# EAGLE design TCS3472_breakout (EAGLE 7.3.0)
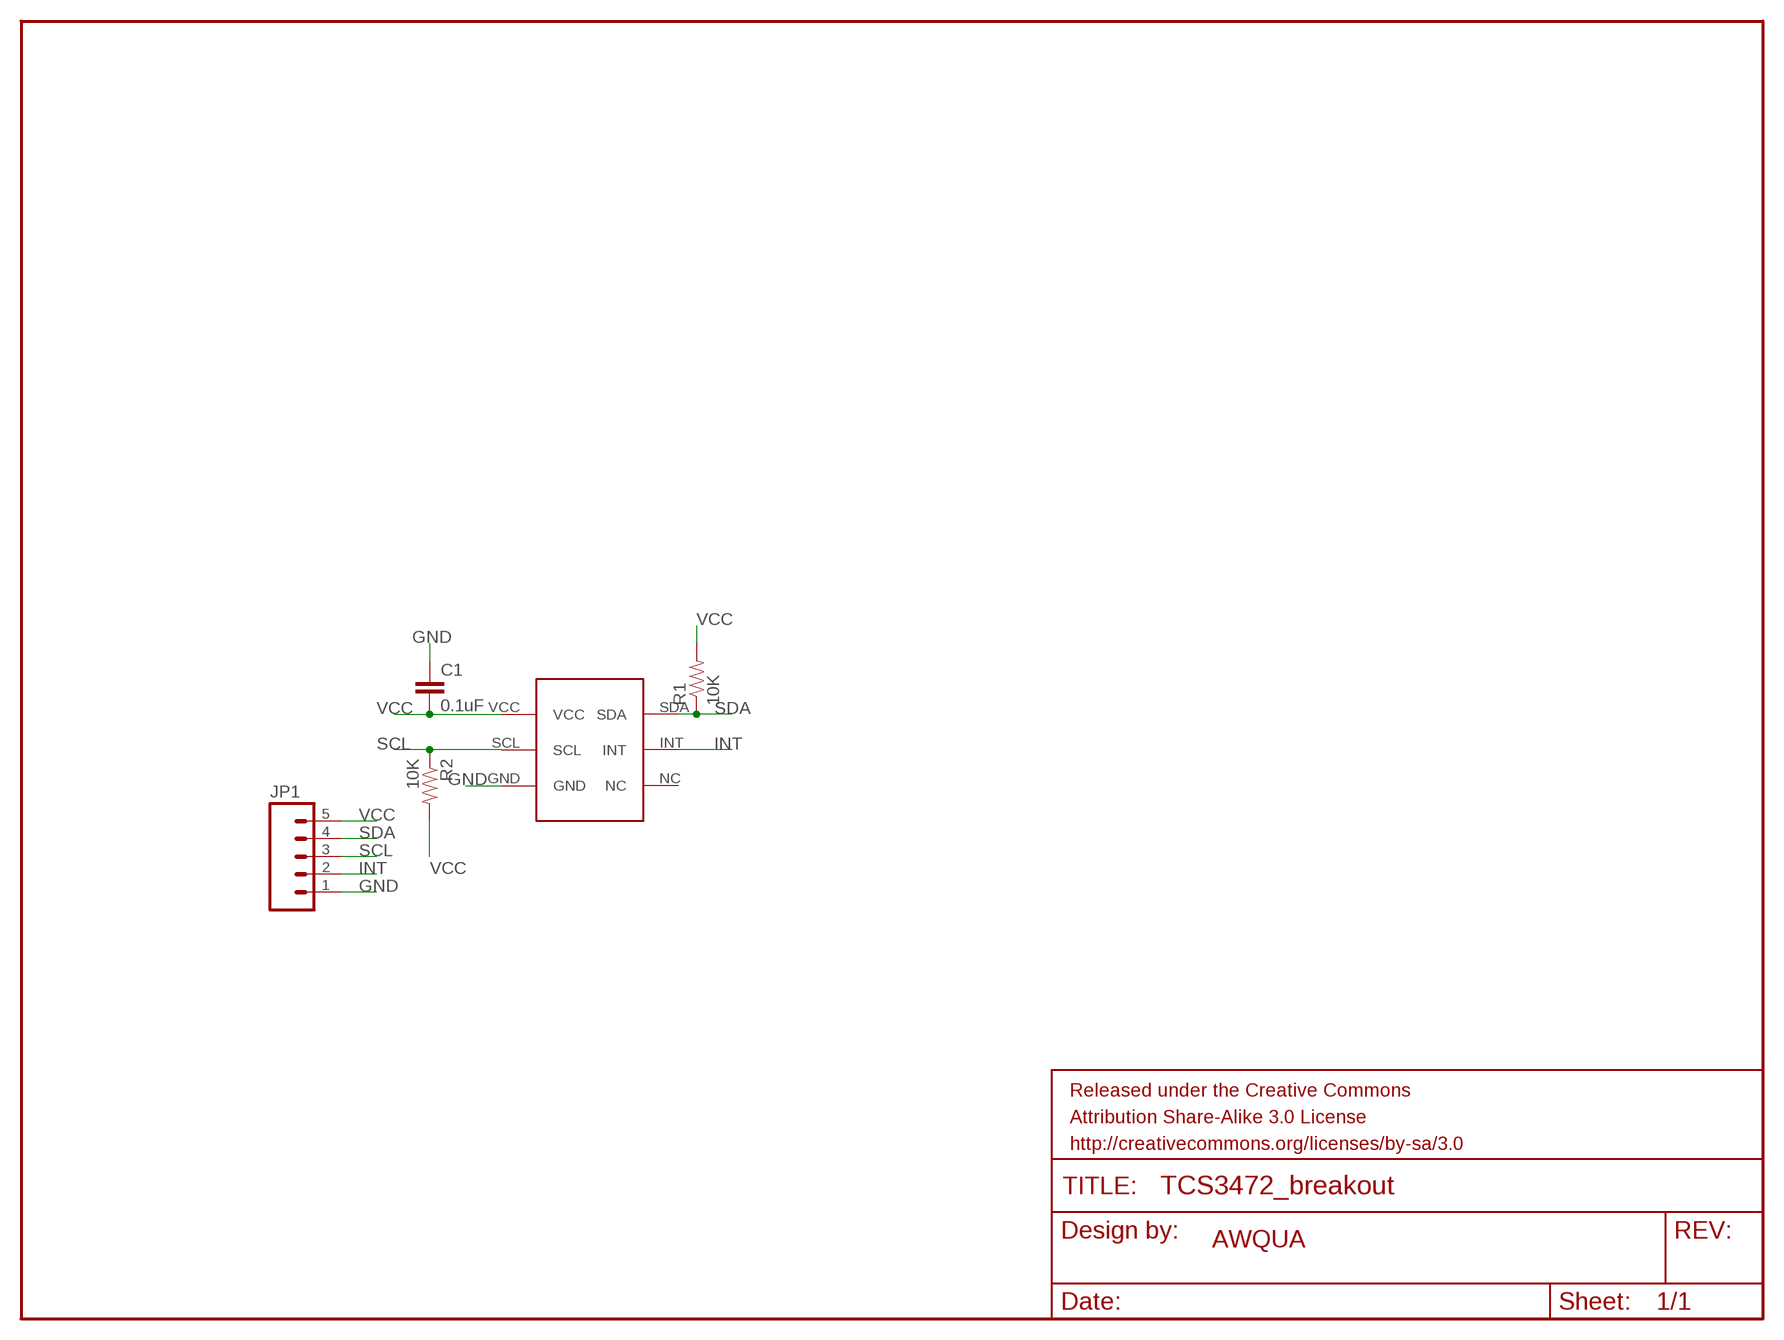
[diagram p0: schematic, sheet 1]

## Parts
C1  0.1uF  CAP0603-CAP  [0603-CAP]
FRAME1  FRAME-LETTER  [CREATIVE_COMMONS]
JP1  M05NO_SILK  [1X05_NO_SILK]
R1  10K  RESISTOR0603-RES  [0603-RES]
R2  10K  RESISTOR0603-RES  [0603-RES]
U$2  TCS3472  [TCS3472]

## Nets
GND: C1.1 JP1.1 U$2.GND
INT: JP1.2 U$2.INT
SCL: JP1.3 R2.1 U$2.SCL
SDA: JP1.4 R1.1 U$2.SDA
VCC: C1.2 JP1.5 R1.2 R2.2 U$2.VCC
Unconnected: U$2.NC

## Notes on the sheet
- AWQUA

## Library data of the parts
C1 = SparkFun-Passives:CAP: Capacitor Standard 0603 ceramic capacitor, and 0.1" leaded capacitor.
FRAME1 = SparkFun-Aesthetics:FRAME-LETTER: Schematic Frame Standard 8.5x11 US Letter frame
JP1 = SparkFun-Connectors:M05: Header 5 Standard 5-pin 0.1" header. Use with straight break away headers (SKU : PRT-00116), right angle break away headers (PRT-00553), swiss pins (PRT-00743), machine pins (PRT-00117), and female headers (PRT-00115). Molex polarized connector foot print use with SKU : PRT-08230 with associated crimp pins and housings.
R1 R2 = SparkFun-Passives:RESISTOR: Resistor Basic schematic elements and footprints for 0603, 1206, and PTH resistors.
U$2 = awqua_eagle_library:TCS3472

## Board
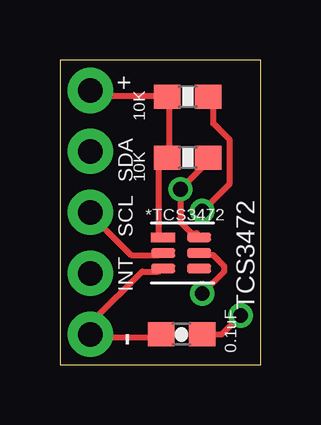
[diagram p1: board, top side]
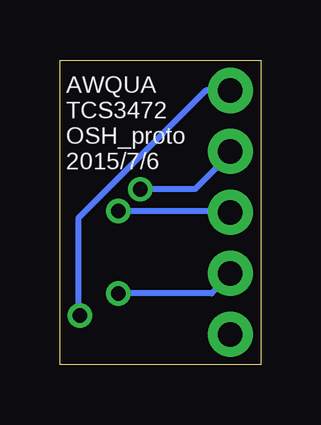
[diagram p2: board, bottom side, seen from below]

Size 8.38 x 12.7 mm. Coordinates in mm from the lower left corner, seen from the top.
Outline: 0,0 8.38,0 8.38,12.7 0,12.69 0,0
Copper layers (1*16): Top 0.035mm / dielectric 1.5mm / Bottom 0.035mm
Design rules "default": minimum track width 10mil, minimum drill 24mil, track to track 8mil, track to pad 8mil, pad to pad 8mil, via to via 8mil, smd to smd 8mil, copper to edge 40mil, drill to drill 8mil, minimum pad ring 10mil, minimum via ring 8mil, stop-mask expansion 4mil, vias tented up to drill 0mil, thermal gap 10mil

### Footprints (pad centres in the part's own frame; a part is rotated, then mirrored left to right if it is on the bottom)
0603-CAP = smd 1.1 x 1: 1 -0.85,0; 2 0.85,0
1X05_NO_SILK = drill 1.016 pad 1.88: 1 0,0; 2 2.54,0; 3 5.08,0; 4 7.62,0; 5 10.16,0
0603-RES = smd 1.1 x 1: 1 -0.85,0; 2 0.85,0
TCS3472 = smd 1 x 0.4: GND 0.5,0.2; INT 2,0.85; NC 2,0.2; SCL 0.5,0.85; SDA 2,1.5; VCC 0.5,1.5

### Placement (x,y rotation side)
C1  5.08,1.27 0 top
FRAME1  2.54,-10.41 0 top  (outside the outline)
JP1  1.27,1.27 90 top
R1  5.33,8.64 180 top
R2  5.33,11.18 180 top
U$2  3.81,3.81 0 top

### Tracks (layer width: path | path; a pad name or v marks a point on that pad's centre or on a via)
GND
  Top 0.254: U$2.GND 4.12,3.89 3.43,3.89 1.37,1.83 1.37,1.37 JP1.1 1.37,1.14 4.12,1.14 C1.1
INT  (via drill 0.61)
  Top 0.254: v5.94,2.97 6.86,3.89 6.86,4.12 6.4,4.57 5.94,4.57 U$2.INT
  Bottom 0.254: v5.94,2.97 2.06,2.97 1.37,3.66 JP1.2
SCL  (via drill 0.61)
  Top 0.254: U$2.SCL 4.12,4.57 2.97,4.57 1.37,6.17 JP1.3 | v5.94,6.4 7.09,7.54 7.09,9.37 6.4,10.06 6.4,10.97 R2.1
  Bottom 0.254: v5.94,6.4 1.37,6.4 JP1.3
SDA  (via drill 0.61)
  Top 0.254: U$2.SDA 5.71,5.49 5.49,5.49 5.03,5.94 v5.03,7.32 6.17,8.46 R1.1
  Bottom 0.254: v5.03,7.32 2.74,7.32 1.37,8.69 JP1.4
VCC  (via drill 0.61)
  Top 0.254: U$2.VCC 4.12,5.49 4.12,8.23 4.34,8.46 R1.2 4.57,8.69 4.57,10.97 R2.2 4.34,11.2 1.6,11.2 1.37,11.43 JP1.5 | 5.71,1.37 C1.2 6.76,1.27 v7.54,2.06
  Bottom 0.254: JP1.5 2.29,11.43 7.62,6.1 7.62,2.13 v7.54,2.06

### Text on the board
tNames: + | SDA | TCS3472 | SCL | INT | - | AWQUA
bNames: AWQUA / TCS3472 / OSH_proto / 2015/7/6